# Altium project BrahMos.PrjPcb
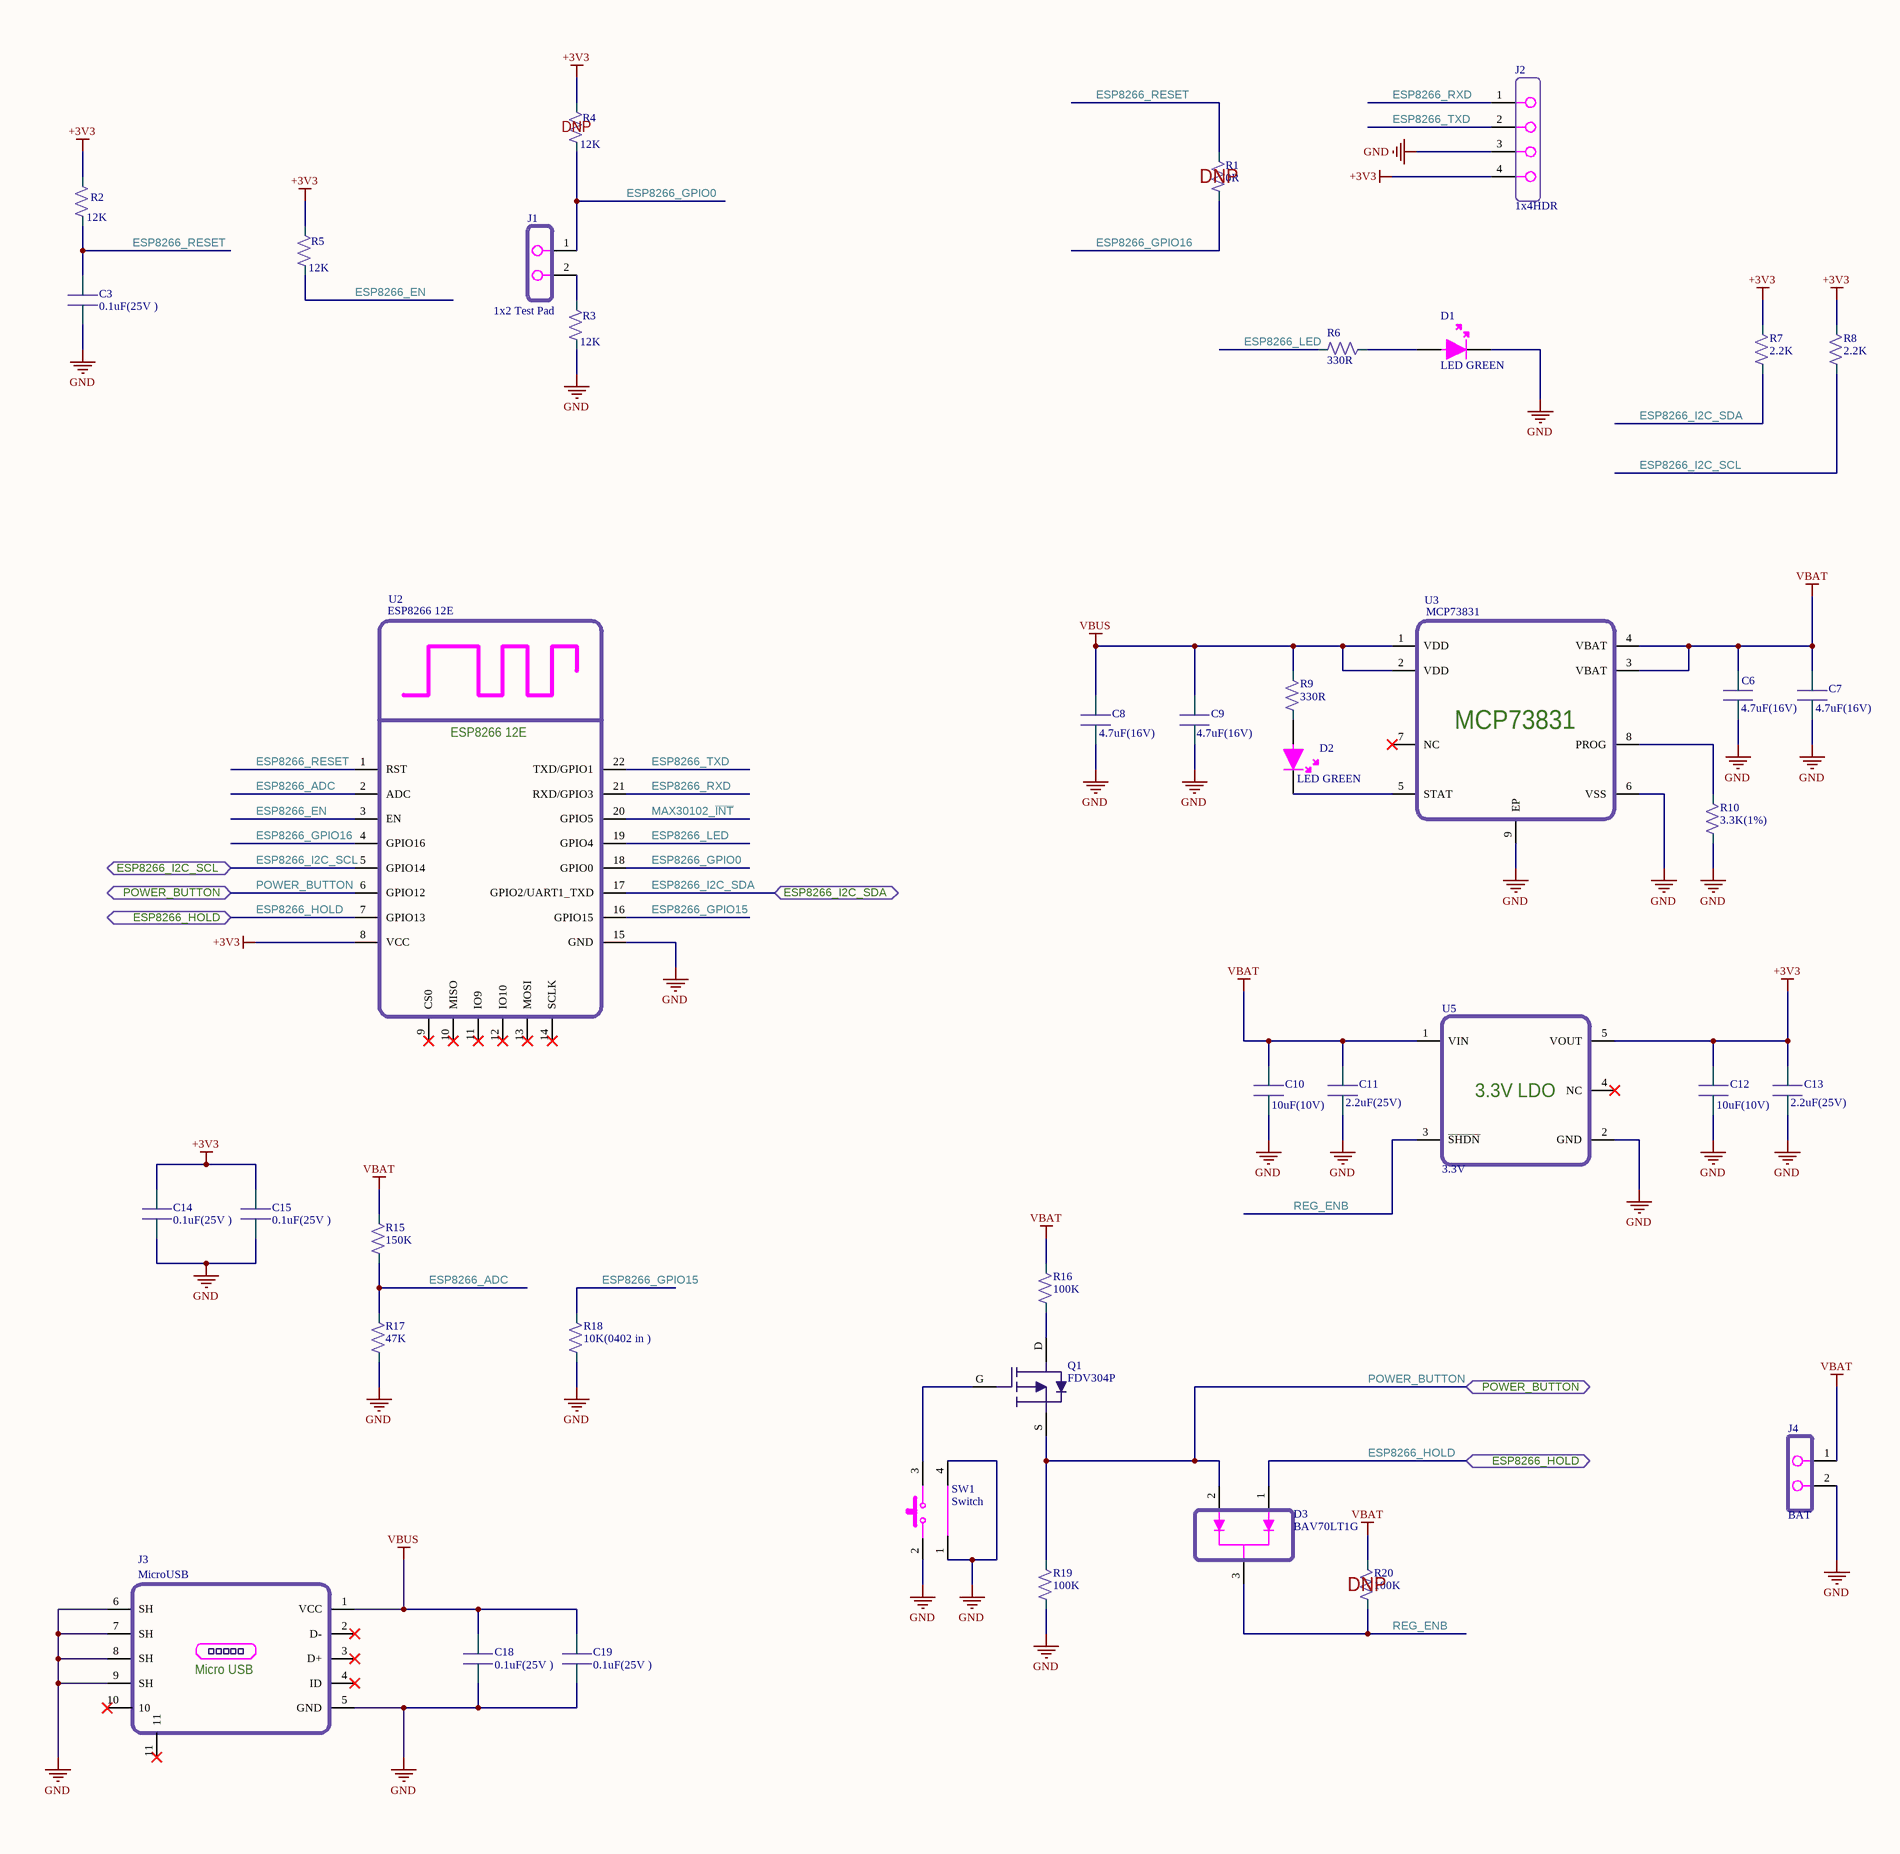
[diagram p0: BrahMos_ESP8266.SchDoc, left]
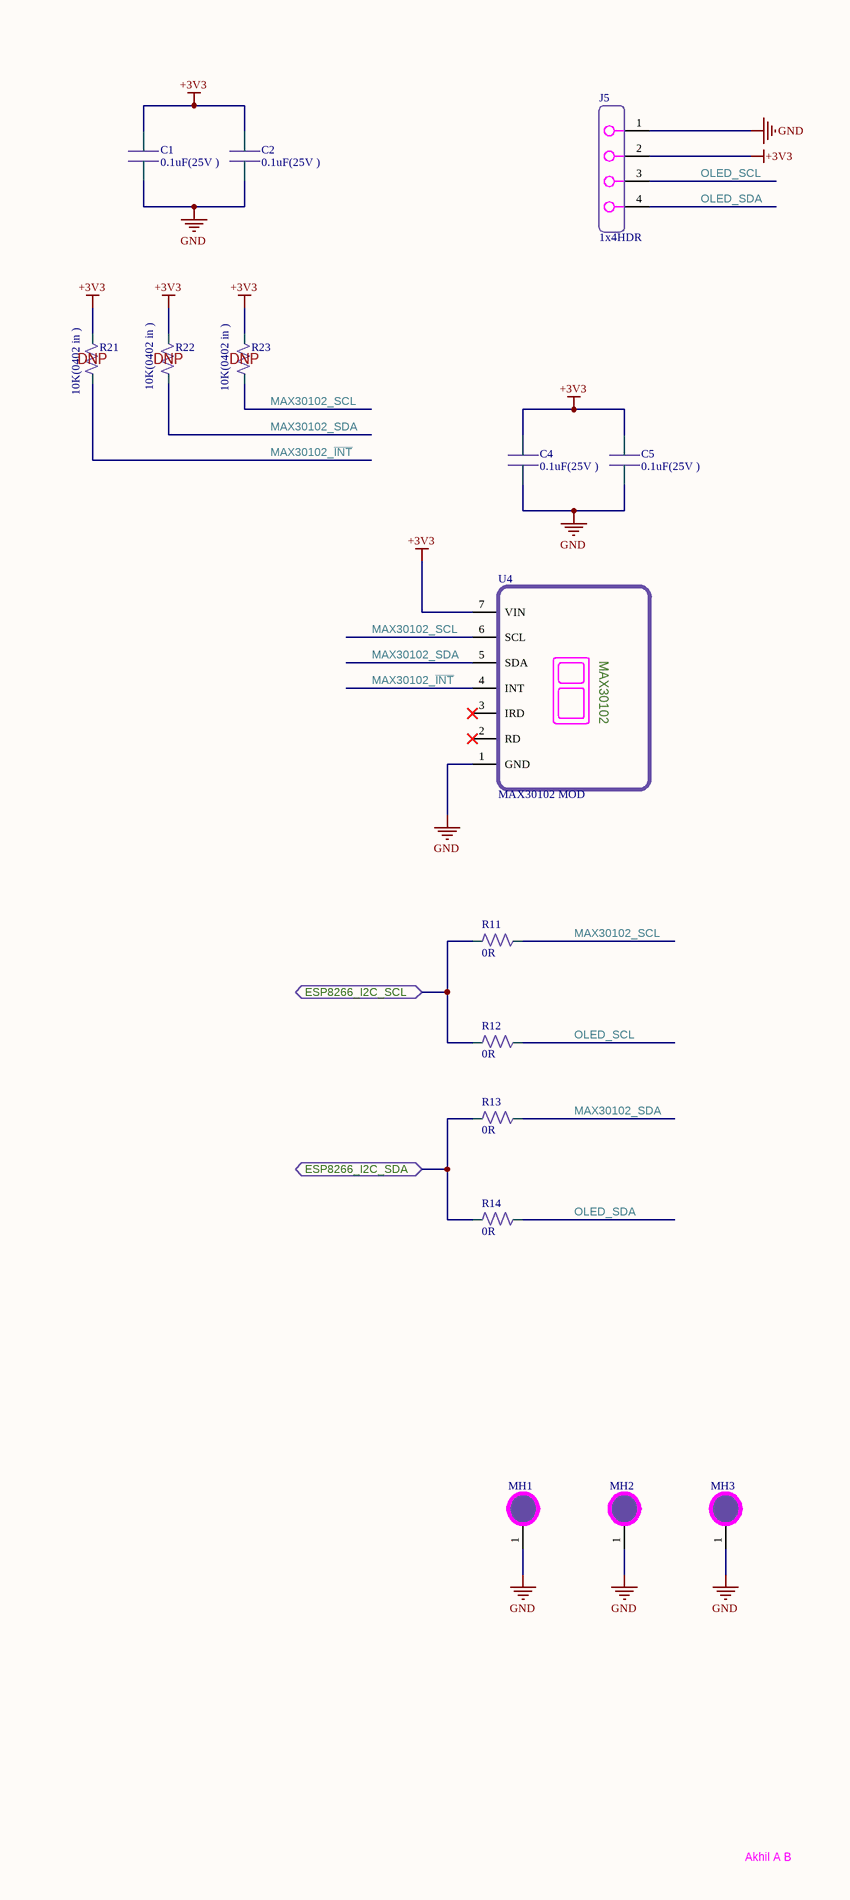
[diagram p1: BrahMos_ESP8266.SchDoc, right]
1 sheet, 57 parts. Net scope: flat (ports and power ports of the same name join across sheets).
Board file: OxymeterPCB.PcbDoc

## Sheet BrahMos_ESP8266.SchDoc: ESP8266_Oxymeter
size A2; SheetNumber: 1; SheetTotal: 1

### Parts
C1  0.1uF(25V )  [CAPACITOR_0402]
C2  0.1uF(25V )  [CAPACITOR_0402]
C3  0.1uF(25V )  [CAPACITOR_0402]
C4  0.1uF(25V )  [CAPACITOR_0402]
C5  0.1uF(25V )  [CAPACITOR_0402]
C6  4.7uF(16V)  [CAPACITOR_0402]
C7  4.7uF(16V)  [CAPACITOR_0402]
C8  4.7uF(16V)  [CAPACITOR_0402]
C9  4.7uF(16V)  [CAPACITOR_0402]
C10  10uF(10V)  [CAPACITOR_0402]
C11  2.2uF(25V)  [CAPACITOR_0402]
C12  10uF(10V)  [CAPACITOR_0402]
C13  2.2uF(25V)  [CAPACITOR_0402]
C14  0.1uF(25V )  [CAPACITOR_0402]
C15  0.1uF(25V )  [CAPACITOR_0402]
C18  0.1uF(25V )  [CAPACITOR_0402]
C19  0.1uF(25V )  [CAPACITOR_0402]
D1  LED GREEN  [0603_LED]
D2  LED GREEN  [0603_LED]
D3  BAV70LT1G  [SOT-23_3LEAD - BAV70]
J1  1x2 Test Pad  [dual test pad 1.27]
J2  1x4HDR  [P2.541X4HDR]
J3  MicroUSB  [Micro USB]
J4  BAT  [SM02B-SRSS-TB(LF)(SN)]
J5  1x4HDR  [P2.541X4HDR]
MH1  Mounting Hole  [2mm mounting Hole]  (value not drawn)
MH2  Mounting Hole  [2mm mounting Hole]  (value not drawn)
MH3  Mounting Hole  [2mm mounting Hole]  (value not drawn)
Q1  FDV304P  [SOT-23_3LEAD]
R1  0R  [RESISTOR_0402]
R2  12K  [RESISTOR_0402]
R3  12K  [RESISTOR_0402]
R4  12K  [RESISTOR_0402]
R5  12K  [RESISTOR_0402]
R6  330R  [RESISTOR_0402]
R7  2.2K  [RESISTOR_0402]
R8  2.2K  [RESISTOR_0402]
R9  330R  [RESISTOR_0402]
R10  3.3K(1%)  [RESISTOR_0402]
R11  0R  [RESISTOR_0402]
R12  0R  [RESISTOR_0402]
R13  0R  [RESISTOR_0402]
R14  0R  [RESISTOR_0402]
R15  150K  [RESISTOR_0402]
R16  100K  [RESISTOR_0402]
R17  47K  [RESISTOR_0402]
R18  10K(0402 in )  [RESISTOR_0402]
R19  100K  [RESISTOR_0402]
R20  100K  [RESISTOR_0402]
R21  10K(0402 in )  [RESISTOR_0402]
R22  10K(0402 in )  [RESISTOR_0402]
R23  10K(0402 in )  [RESISTOR_0402]
SW1  Switch  [right angle through hole switch]
U2  ESP8266 12E  [ESP8266 12F]
U3  MCP73831  [8VFDFN]
U4  MAX30102 MOD  [MAX30102 MODULE]
U5  3.3V  [SOT23-5LEAD]

### Ports
ESP8266_HOLD (bidir), ESP8266_I2C_SCL (bidir), ESP8266_I2C_SDA (bidir), POWER_BUTTON (bidir)

### Nets
+3V3: C1.2 C2.2 C4.2 C5.2 C12.2 C13.2 C14.2 C15.2 J2.4 J5.2 R2.2 R4.2 R5.2 R7.2 R8.2 R21.2 R22.2 R23.2 U2.8(VCC) U4.7(VIN) U5.5(VOUT)
GND: C1.1 C2.1 C3.1 C4.1 C5.1 C6.1 C7.1 C8.1 C9.1 C10.1 C11.1 C12.1 C13.1 C14.1 C15.1 C18.1 C19.1 D1.2 J2.3 J3.5(GND) J3.6(SH) J3.7(SH) J3.8(SH) J3.9(SH) J4.2 J5.1 MH1.1 MH2.1 MH3.1 R3.1 R10.1 R17.1 R18.1 R19.1 SW1.1 SW1.2 SW1.4 U2.15(GND) U3.6(VSS) U3.9(EP) U4.1(GND) U5.2(GND)
VBAT: C6.2 C7.2 C10.2 C11.2 J4.1 R15.2 R16.2 R20.2 U3.3(VBAT) U3.4(VBAT) U5.1(VIN)
VBUS: C8.2 C9.2 C18.2 C19.2 J3.1(VCC) R9.2 U3.1(VDD) U3.2(VDD)
ESP8266_ADC: R15.1 R17.2 U2.2(ADC)
ESP8266_EN: R5.1 U2.3(EN)
ESP8266_GPIO0: J1.1 R4.1 U2.18(GPIO0)
ESP8266_GPIO15: R18.2 U2.16(GPIO15)
ESP8266_GPIO16: R1.1 U2.4(GPIO16)
ESP8266_HOLD: D3.1 U2.7(GPIO13) ; port ESP8266_HOLD
ESP8266_I2C_SCL: R8.1 R11.1 R12.1 U2.5(GPIO14) ; port ESP8266_I2C_SCL
ESP8266_I2C_SDA: R7.1 R13.1 R14.1 U2.17(GPIO2/UART1_TXD) ; port ESP8266_I2C_SDA
ESP8266_LED: R6.1 U2.19(GPIO4)
ESP8266_RESET: C3.2 R1.2 R2.1 U2.1(RST)
ESP8266_RXD: J2.1 U2.21(RXD/GPIO3)
ESP8266_TXD: J2.2 U2.22(TXD/GPIO1)
MAX30102_~{INT}: R21.1 U2.20(GPIO5) U4.4(INT)
MAX30102_SCL: R11.2 R23.1 U4.6(SCL)
MAX30102_SDA: R13.2 R22.1 U4.5(SDA)
OLED_SCL: J5.3 R12.2
OLED_SDA: J5.4 R14.2
POWER_BUTTON: D3.2 Q1.S R19.2 U2.6(GPIO12) ; port POWER_BUTTON
REG_ENB: D3.3 R20.1 U5.3(~{SHDN})
NetD1_1: D1.1 R6.2
NetD2_1: D2.1 R9.1
NetD2_2: D2.2 U3.5(STAT)
NetJ1_2: J1.2 R3.2
NetQ1_D: Q1.D R16.1
NetQ1_G: Q1.G SW1.3
NetR10_2: R10.2 U3.8(PROG)

Not connected (* = marked no-connect by the designer): J3 2(D-)* 3(D+)* 4(ID)* 10* 11*; U2 9(CS0)* 10(MISO)* 11(IO9)* 12(IO10)* 13(MOSI)* 14(SCLK)*; U3 7(NC)*; U4 2(RD)* 3(IRD)*; U5 4(NC)*

### Notes on the sheet
- (near R4) DNP
- (near R1) DNP
- (near R21) DNP
- (near R22) DNP
- (near R23) DNP
- (near R20) DNP
- Akhil A B
- (in symbol 629105150521) Micro USB
- (in symbol MAX30102 MOD) MAX30102
- (in symbol MCP1812BT-033/OT) 3.3V LDO

### Library data of the parts
C1-C5 C14 C15 C18 C19 = GRM155R71E104KE14J: 0.1µF ±10% 25V Ceramic Capacitor X7R 0402 (1005 Metric); Manufacturer: Murata Electronics; MinTemp: -55°C; MaxTemp: 125°C; ManufacturerPartNumber: GRM155R71E104KE14J; SupplierPartNumber: 490-14603-1-ND; Supplier: Digikey; PartStatus: Active; Price: 0.10; ComponentLink1Description: SupplierURL; ComponentLink1URL: https://www.digikey.com/en/products/detail/murata-electronics/GRM155R71E104KE14J/4905174
C6-C9 = 0402YD475MAT2A: 4.7µF ±20% 16V Ceramic Capacitor X5R 0402 (1005 Metric); Manufacturer: AVX Corporation; MinTemp: -55°C; MaxTemp: 85°C; ManufacturerPartNumber: 0402YD475MAT2A; SupplierPartNumber: 478-10788-1-ND; PartStatus: Active; Price: 0.29; ComponentLink1Description: SupplierURL; ComponentLink1URL: https://www.digikey.com/en/products/detail/avx-corporation/0402YD475MAT2A/6221357; Supplier: Digikey
C10 C12 = CL05A106MP8NUB8: 10µF ±20% 10V Ceramic Capacitor X5R 0402 (1005 Metric); Manufacturer: Samsung Electro-Mechanics; MinTemp: -55°C; MaxTemp: 85°C; ManufacturerPartNumber: CL05A106MP8NUB8; SupplierPartNumber: 1276-6830-1-ND; Supplier: Digikey; PartStatus: Active; Price: 0.36; ComponentLink1Description: SupplierURL; ComponentLink1URL: https://www.digikey.com/en/products/detail/samsung-electro-mechanics/CL05A106MP8NUB8/5961314
C11 C13 = GRT155R61E225KE13D: 2.2 µF ±10% 25V Ceramic Capacitor X5R 0402 (1005 Metric); Manufacturer: Murata Electronics; PartSatus: Active; MinTemp: -55°C; MaxTemp: 85°C; ManuafcturerPartNumber: GRT155R61E225KE13D; SupplierPartNumber: 490-12267-1-ND; Supplier: Digikey; Price: 0.29; ComponentLink1Description: SupplierURL; ComponentLink1URL: https://www.digikey.com/en/products/detail/murata-electronics/GRT155R61E225KE13D/5416689
D1 D2 = XZVG53W-8: Green 570nm LED Indication - Discrete 2.1V 0603 (1608 Metric); Min Temp: -40°C; Max Temp: +85°C; Manufacturer Part Number: XZVG53W-8; Supplier Part Number: 1497-1215-1-ND; Part Status: Active; Price: 0.36; ComponentLink1Description: Supplier Link; ComponentLink1URL: https://www.digikey.com/en/products/detail/sunled/XZVG53W-8/4745971
D3 = BAV70LT1G: Diode Array 1 Pair Common Cathode Standard 200mA (DC) Surface Mount TO-236-3, SC-59, SOT-23-3; Manufacturer: ON Semiconductor; MinTemp: -55°C; MaxTemp: 150°C; ManufacturerPartNumber: BAV70LT1G; SupplierPartNumber: BAV70LT1GOSCT-ND; Supplier: Digikey; PartStatus: Active; Price: 0.14; ComponentLink1Description: SupplierURL; ComponentLink1URL: https://www.digikey.com/en/products/detail/on-semiconductor/BAV70LT1G/918324
J1 = 1x2Test Pad
J2 J5 = PEC04SAAN: Connector Header Through Hole 4 position 0.100" (2.54mm); Maanufacturer: Sullins Connector Solutions; MinTemp: -65°C; MaxTemp: 125°C; ManufacturerPartNumber: PEC04SAAN; SupplierPartNumber: S1012E-04-ND; Supplier: Digikey; PartStatus: Active; Price: 0.27; ComponentLink1Description: SupplierURL; ComponentLink1URL: https://www.digikey.com/en/products/detail/sullins-connector-solutions/PEC04SAAN/859157
J3 = 629105150521: USB - micro B USB 2.0 Receptacle Connector 5 Position Surface Mount, Right Angle; Through Hole; Manufacturer: Würth Elektronik; MinTemp: -40°C; MaxTemp: 85°C; ManufacturerPartNumber: 629105150521; SupplierPartNumber: 732-5960-1-ND; Supplier: Digikey; PartStatus: Active; Price: 2.07; ComponentLink1Description: SupplierURL; ComponentLink1URL: https://www.digikey.com/en/products/detail/würth-elektronik/629105150521/5047751
J4 = SM02B-SRSS-TB(LF)(SN): Connector Header Surface Mount, Right Angle 2 position 0.039" (1.00mm); Manufacturer: JST Sales America Inc.; MinTemp: -25°C; MaxTemp: 85°C; ManufacturerPartNumber: SM02B-SRSS-TB(LF)(SN); SupplierPartNumber: 455-1802-1-ND; Supplier: Digikey; PartStatus: Active; Price: 0.47; ComponentLink1Description: SupplierURL; ComponentLink1URL: https://www.digikey.com/en/products/detail/jst-sales-america-inc/SM02B-SRSS-TB-LF-SN/926708
MH1-MH3 = 2mm mounting hole
Q1 = FDV304P: P-Channel 460mA (Ta) 350mW (Ta) Surface Mount SOT-23; Manufacturer: ON Semiconductor; MinTemp: -55°C; MaxTemp: 150°C; ManufacturerPartNumber: FDV304P; SupplierPartNumber: FDV304PCT-ND; Supplier: Digikey; PartStatus: Active; Price: 0.34; ComponentLink1Description: SupplierURL; ComponentLink1URL: https://www.digikey.com/en/products/detail/on-semiconductor/FDV304P/458854; ComponentLink2Description: MouserURL; ComponentLink2URL: https://www.mouser.in/ProductDetail/Microchip-Technology/MCP1812BT-033-OT?qs=byeeYqUIh0NTmNeIvl%2Fnbw%3D%3D
R1 R11-R14 = CR0402AJ/-000GAS: Jumper 0.063W, 1/16W Chip Resistor 0402 (1005 Metric) Anti-Sulfur, Automotive AEC-Q200, Moisture Resistant Thick Film; Manufacturer: Bourns Inc.; MinTemp: -55°C; MaxTemp: 155°C; ManufacturerPartNumber: CR0402AJ/-000GAS; SupplierPartNumber: CR0402AJ/-000GASCT-ND; Supplier: Digikey; PartStatus: Active; Price: 0.10; ComponentLink1Description: SupplierURL; ComponentLink1URL: https://www.digikey.com/en/products/detail/bourns-inc/CR0402AJ-000GAS/10240110
R2-R5 = ERJ-2GEJ123X: ±5% 0.1W, 1/10W Chip Resistor 0402 (1005 Metric) Automotive AEC-Q200 Thick Film; Manufacturer: Panasonic Electronic Components; MinTemp: -55°C; MaxTemp: 155°C; ManufacturerPartNumber: ERJ-2GEJ123X; SupplierPartNumber: P12KJCT-ND; Supplier: Digikey; PartStatus: Active; Price: 0.10; ComponentLink1Description: SupplierURL; ComponentLink1URL: https://www.digikey.com/en/products/detail/panasonic-electronic-components/ERJ-2GEJ123X/146864
R6 R9 = CRGCQ0603J330R: ±5% 0.1W, 1/10W Chip Resistor 0603 (1608 Metric) Automotive AEC-Q200, Moisture Resistant Thick Film; Manufacturer: TE Connectivity Passive Product; MinTemp: -55°C; MaxTemp: 155°C; ManufacturerPartNumber: CRGCQ0603J330R; SupplierPartNumber: A130088CT-ND; Supplier: Digikey; PartStatus: Active; Price: 0.10; ComponentLink1Description: SupplierURL; ComponentLink1URL: https://www.digikey.com/en/products/detail/te-connectivity-passive-product/CRGCQ0603J330R/8576690
R7 R8 = ERJ-2GEJ222X: 2.2 kOhms ±5% 0.1W, 1/10W Chip Resistor 0402 (1005 Metric) Automotive AEC-Q200 Thick Film; Manufacturer: Panasonic Electronic Components; MinTemp: -55°C; MaxTemp: 155°C; ManufacturerPartNumber: ERJ-2GEJ222X; SupplierPartNumber: P2.2KJCT-ND; Supplier: Digikey; PartStatus: Active; Price: 0.10; ComponentLink1Description: SupplierURL; ComponentLink1URL: https://www.digikey.com/en/products/detail/panasonic-electronic-components/ERJ-2GEJ222X/146962
R10 = RK73H1ETTP3301F: 3.3 ±1% 0.1W, 1/10W Chip Resistor 0402 (1005 Metric) Automotive AEC-Q200, Moisture Resistant Thick Film; Manufacturer: KOA Speer Electronics, Inc.; MinTemp: -55°C; MaxTemp: 155°C; ManufacturerPartNumber: RK73H1ETTP3301F; SupplierPartNumber: 2019-RK73H1ETTP3301FCT-ND; Supplier: Digikey; PartStatus: Active; Price: 0.10; ComponentLink1Description: SupplierURL; ComponentLink1URL: https://www.digikey.com/en/products/detail/koa-speer-electronics-inc/RK73H1ETTP3301F/9844094
R15 = ERJ-2GEJ154X: 150 kOhms ±5% 0.1W, 1/10W Chip Resistor 0402 (1005 Metric) Automotive AEC-Q200 Thick Film; Manufacturer: Panasonic Electronic Components; MinTemp: -55°C; MaxTemp: 155°C; ManufacturerPartNumber: ERJ-2GEJ154X; SupplierPartNumber: P150KJCT-ND; Supplier: Digikey; PartStatus: Active; Price: 0.10; ComponentLink1Description: SupplierURL; ComponentLink1URL: https://www.digikey.com/en/products/detail/panasonic-electronic-components/ERJ-2GEJ154X/146876
R16 R19 R20 = ERJ-2GEJ104X: 100 kOhms ±5% 0.1W, 1/10W Chip Resistor 0402 (1005 Metric) Automotive AEC-Q200 Thick Film; Manufacturer: Panasonic Electronic Components; MinTemp: -55°C; MaxTemp: 155°C; ManufacturerPartNumber: ERJ-2GEJ104X; SupplierPartNumber: P100KJCT-ND; Supplier: Digikey; PartStatus: Active; Price: 0.10; ComponentLink1Description: SupplierURL; ComponentLink1URL: https://www.digikey.com/en/products/detail/panasonic-electronic-components/ERJ-2GEJ104X/146731
R17 = ERJ-U02J473X: 47 kOhms ±5% 0.1W, 1/10W Chip Resistor 0402 (1005 Metric) Anti-Sulfur, Automotive AEC-Q200 Thick Film; Manufacturer: Panasonic Electronic Components; MinTemp: -55°C; MaxTemp: 155°C; ManufacturerPartNumber: ERJ-U02J473X; SupplierPartNumber: 10-ERJ-U02J473XCT-ND; Supplier: Digikey; PartStatus: Active; Price: 0.10; ComponentLink1Description: SupplierURL; ComponentLink1URL: https://www.digikey.com/en/products/detail/panasonic-electronic-components/ERJ-U02J473X/11642662
R18 R21-R23 = ERJ-U02J103X: 10 kOhms ±5% 0.1W, 1/10W Chip Resistor 0402 (1005 Metric) Anti-Sulfur, Automotive AEC-Q200 Thick Film; Manufacturer: Panasonic Electronic Components; MinTemp: -55°C; MaxTemp: 155°C; ManufacturerPartNumber: ERJ-U02J103X; SupplierPartNumber: 10-ERJ-U02J103XCT-ND; PartStatus: Active; Price: 0.10; ComponentLink1Description: SupplierURL; ComponentLink1URL: https://www.digikey.com/en/products/detail/panasonic-electronic-components/ERJ-U02J103X/11631335; Supplier: Digikey
SW1 = 1301.9502: Tactile Switch SPST-NO Side Actuated Through Hole, Right Angle; Manufacturer: Schurter Inc.; MinTemp: -20°C; MaxTemp: 70°C; ManufacturerPartNumber: 1301.9502; SupplierPartNumber: 486-3472-ND; Supplier: Digikey; PartStatus: Active; Price: 0.30; ComponentLink1Description: SupplierURL; ComponentLink1URL: https://www.digikey.com/en/products/detail/schurter-inc/1301-9502/7602720; ComponentLink2Description: rydoLabs; ComponentLink2URL: https://www.rhydolabz.com/hardwares-switches-c-170_171/right-angle-tactile-push-button-switch-5mm-shaft-dip-p-2817.html
U3 = MCP73831T-2DCI/MC: Charger IC Lithium Ion/Polymer 8-DFN (2x3); Manufacturer: Microchip Technology; MinTemp: -40°C; MaxTemp: 85°C; ManufacturerPartNumber: MCP73831T-2DCI/MC; SupplierPartNumber: MCP73831T-2DCI/MCCT-ND; Supplier: Digikey; PartStatus: Active; Price: 0.62; ComponentLink1Description: SupplierURL; ComponentLink1URL: c
U5 = MCP1812BT-033/OT: LDO Voltage Regulators Ultra Low Iq LDO; Manufacturer: Microchip Technology; MinTemp: - 40 C; MaxTemp: + 85 C; ManuafcturerPartNumber: MCP1812BT-033/OT; SupplierPartNumber: 579-MCP1812BT-033/OT; Supplier: Mouser; PartStatus: Active; Price: 29.11(INR); ComponentLink1Description: SupplierURL; ComponentLink1URL: https://www.mouser.in/ProductDetail/Microchip-Technology/MCP1812BT-033-OT?qs=byeeYqUIh0NTmNeIvl%2Fnbw%3D%3D
U2 = ESP8266 12E: ComponentLink1Description: SupplierURL; ComponentLink1URL: https://robu.in/product/latest-esp-12f-esp8266-wifi-module-ap-station-remote-serial-wireless-iot-board/?gclid=CjwKCAjw7diEBhB-EiwAskVi1w4UTSLqbH_HL7QLR7tzwlfYnduUpPV7CUvSW1M1q-eevm6j812kphoChusQAvD_BwE